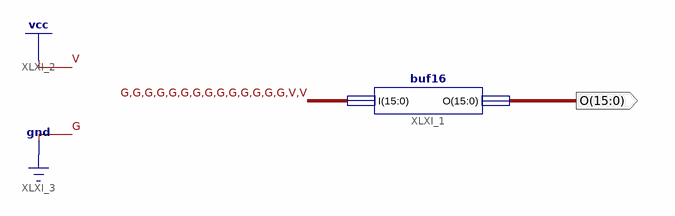
[diagram p0: schematic sheet 1]
// Xilinx ISE schematic constant16b0011.sch (spartan3e) as structural Verilog: 1 symbols, 1 ports
module constant16b0011 (
  output [15:0] O
);

  buf16 XLXI_1 (.I(16'b0000000000000011), .O(O));
endmodule
